# EAGLE schematic motor_driver_adapter (EAGLE 8.7.1)
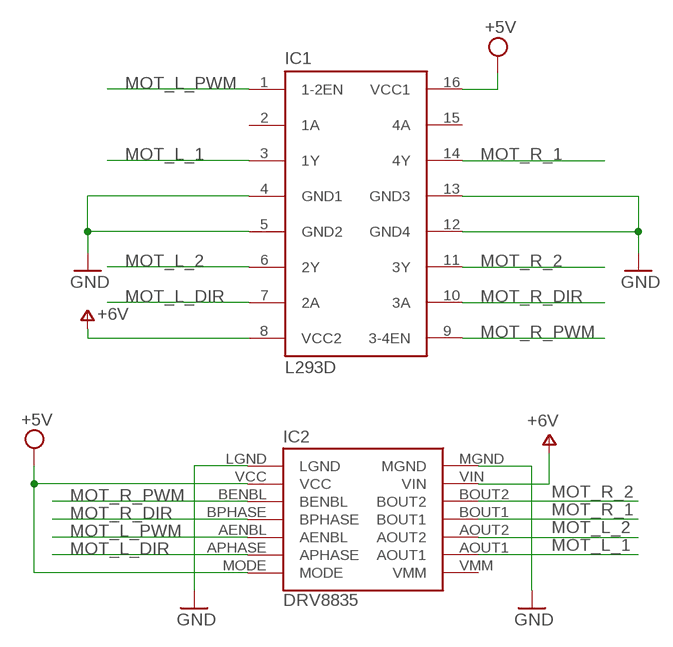
[diagram p0: schematic, sheet 1]

## Parts
IC1  L293D  [DIL16]
IC2  DRV8835  POLOLU_MOTOR_DRV8835THROUGHHOLE  [POLOLU_MOTOR_DRV_DRV8835]

## Nets
+6V: IC1.8(VCC2) IC2.VIN
GND: IC1.4(GND1) IC1.5(GND2) IC1.12(GND4) IC1.13(GND3) IC2.LGND IC2.MGND
MOT_L_1: IC1.3(1Y) IC2.AOUT1
MOT_L_2: IC1.6(2Y) IC2.AOUT2
MOT_L_DIR: IC1.7(2A) IC2.APHASE
MOT_L_PWM: IC1.1(1-2EN) IC2.AENBL
MOT_R_1: IC1.14(4Y) IC2.BOUT1
MOT_R_2: IC1.11(3Y) IC2.BOUT2
MOT_R_DIR: IC1.10(3A) IC2.BPHASE
MOT_R_PWM: IC1.9(3-4EN) IC2.BENBL
VCC: IC1.16(VCC1) IC2.MODE IC2.VCC ; supply symbol labelled +5V
Unconnected: IC1.2(1A) IC1.15(4A) IC2.VMM

## Library data of the parts
IC1 = st-microelectronics:L293D: PUSH-PULL 4 CHANNEL DRIVER; MPN: L293D; OC_FARNELL: 9589619; OC_NEWARK: 56P8249
IC2 = pololu:POLOLU_MOTOR_DRV8835